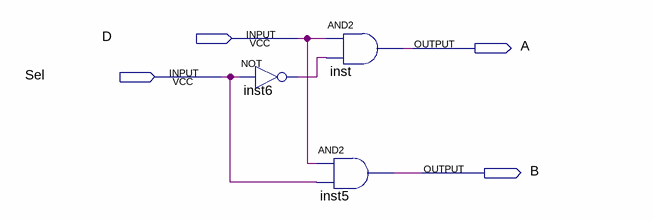
[diagram p0: schematic sheet]
// Quartus schematic DEMUX1x2.bdf as structural Verilog: 3 symbols, 4 pins
module DEMUX1x2 (
  input  D,
  input  Sel,
  output A,
  output B
);

  wire inst6_out;

  not inst6 (inst6_out, Sel);
  and inst (A, D, inst6_out);
  and inst5 (B, D, Sel);
endmodule
